# Altium project micro8051.PrjPcb
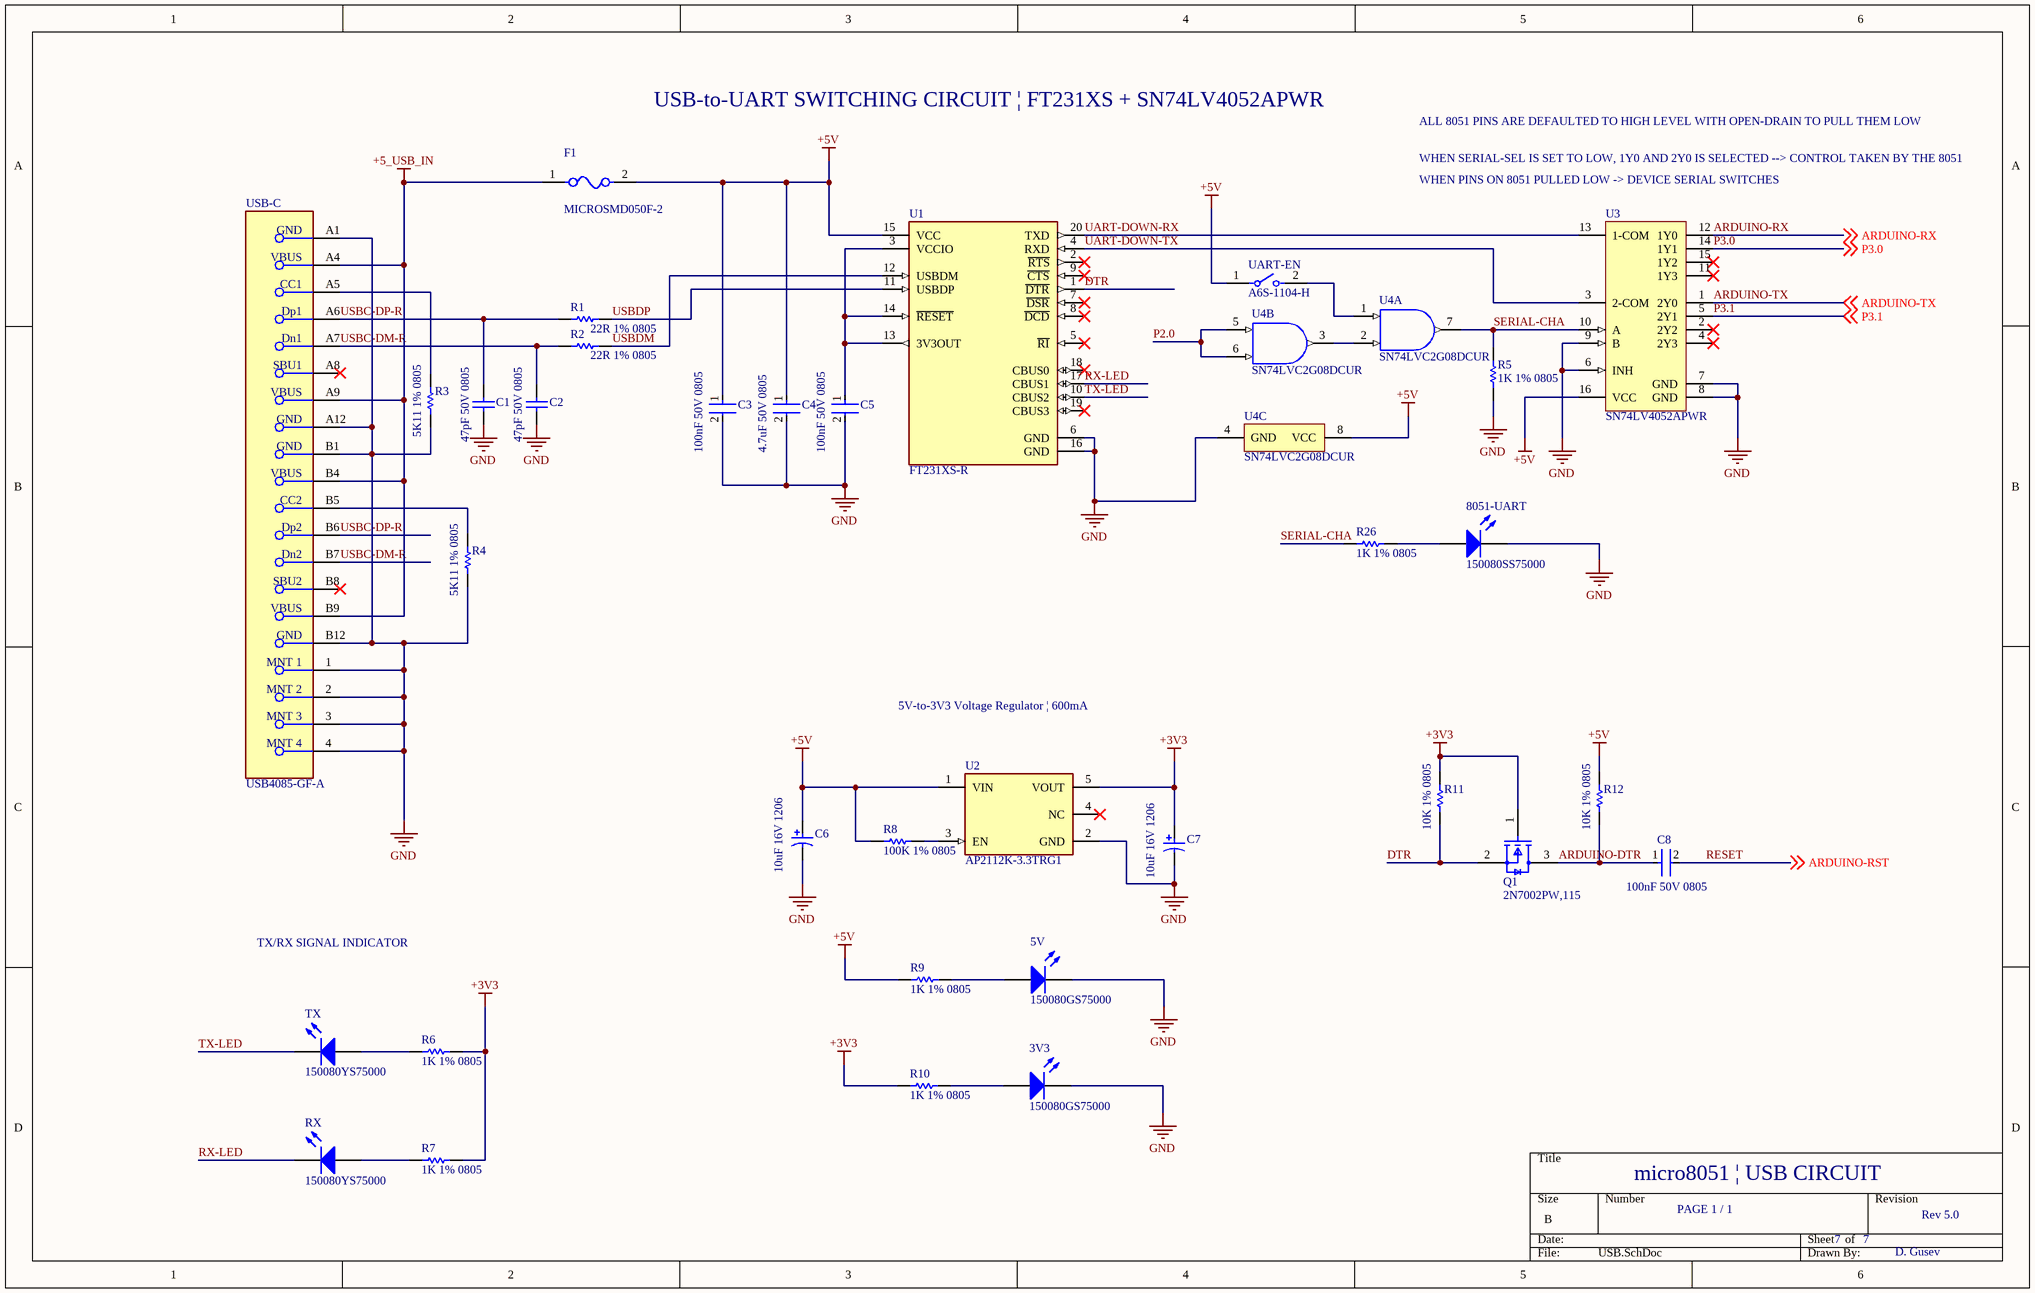
[diagram p0: USB.SchDoc]
3 sheets, 67 parts. Net scope: global (net labels, ports and power ports of the same name join across sheets).
Board file: micro8051.PcbDoc
Sheets:
  USB.SchDoc
  ISP.SchDoc
  micro8051.SchDoc

## Sheet USB.SchDoc
size B

### Parts
3V3  150080GS75000  [0805_A]
5V  150080GS75000  [0805_A]
8051-UART  150080SS75000  [0805_A]
C1  47pF 50V 0805  [CAPC2013X71X50NL20T25]
C2  47pF 50V 0805  [CAPC2013X71X50NL20T25]
C3  100nF 50V 0805  [FP-C0805C-DN-MFG]
C4  4.7uF 50V 0805  [FP-C2012-125-MFG]
C5  100nF 50V 0805  [FP-C0805C-DN-MFG]
C6  10uF 16V 1206  [KEMT-A-3216-18-2_M]
C7  10uF 16V 1206  [KEMT-A-3216-18-2_M]
C8  100nF 50V 0805  [FP-C0805C-DN-MFG]
F1  MICROSMD050F-2  [FP-microSMD-MFG]
Q1  2N7002PW,115  [FP-SOT323-MFG]
R1  22R 1% 0805  [RESC2013X70X40LL20T20]
R2  22R 1% 0805  [RESC2013X70X40LL20T20]
R3  5K11 1% 0805  [RESC0805(2012)_N]
R4  5K11 1% 0805  [RESC0805(2012)_N]
R5  1K 1% 0805  [RESC2013X60X40ML20T25]
R6  1K 1% 0805  [RESC2013X60X40ML20T25]
R7  1K 1% 0805  [RESC2013X60X40ML20T25]
R8  100K 1% 0805  [RESC2013X60X35ML10T20]
R9  1K 1% 0805  [RESC2013X60X40ML20T25]
R10  1K 1% 0805  [RESC2013X60X40ML20T25]
R11  10K 1% 0805  [RESC2013X60X35NL10T20]
R12  10K 1% 0805  [RESC2013X60X35NL10T20]
R26  1K 1% 0805  [RESC2013X60X40ML20T25]
RX  150080YS75000  [0805_A]
TX  150080YS75000  [0805_A]
U1  FT231XS-R  [FP-SSOP-20-MFG]
U2  AP2112K-3.3TRG1  [FP-SOT25-IPC_A]
U3  SN74LV4052APWR  [PW0016A_M]
U4  SN74LVC2G08DCUR  [DCU0008A_M]  (parts A,B,C of 3)
UART-EN  A6S-1104-H  [FP-A6S-1104-H-MFG]
USB-C  USB4085-GF-A  [FP-USB4085-GF-A-MFG]

### Nets
+3V3: C7.1 Q1.1(G) R6.1 R7.1 R10.2 R11.2 U2.5(VOUT)
+5_USB_IN: F1.1 USB-C.A4(VBUS) USB-C.A9(VBUS) USB-C.B4(VBUS) USB-C.B9(VBUS)
+5V: C3.1 C4.1 C6.1 F1.2 R8.2 R9.2 R12.2 U1.15(VCC) U2.1(VIN) U3.16(VCC) U4.8(VCC) UART-EN.1
GND: 3V3.1(K) 5V.1(K) 8051-UART.1(K) C1.1 C2.1 C3.2 C4.2 C5.2 C6.2 C7.2 R3.1 R4.1 R5.2 U1.6(GND) U1.16(GND) U2.2(GND) U3.6(INH) U3.7(GND) U3.8(GND) U3.9(B) U4.4(GND) USB-C.1(MNT_1) USB-C.2(MNT_2) USB-C.3(MNT_3) USB-C.4(MNT_4) USB-C.A1(GND) USB-C.A12(GND) USB-C.B1(GND) USB-C.B12(GND)
ARDUINO-DTR: C8.1 Q1.3(D) R12.1
ARDUINO-RX: U3.12(1Y0) ; off-sheet ARDUINO-RX
ARDUINO-TX: U3.1(2Y0) ; off-sheet ARDUINO-TX
DTR: Q1.2(S) R11.1 U1.1(~{DTR})
P2.0: U4.5(2A) U4.6(2B)
P3.0: U3.14(1Y1) ; off-sheet P3.0
P3.1: U3.5(2Y1) ; off-sheet P3.1
RESET: C8.2 ; off-sheet ARDUINO-RST  [also labelled ARDUINO-RST]
RX-LED: RX.1(K) U1.17(CBUS1)
SERIAL-CHA: R5.1 R26.1 U3.10(A) U4.7(1Y)
TX-LED: TX.1(K) U1.10(CBUS2)
UART-DOWN-RX: U1.20(TXD) U3.13(1-COM)
UART-DOWN-TX: U1.4(RXD) U3.3(2-COM)
USBC-DM-R: C2.2 R2.1 USB-C.A7(Dn1) USB-C.B7(Dn2)
USBC-DP-R: C1.2 R1.1 USB-C.A6(Dp1) USB-C.B6(Dp2)
USBDM: R2.2 U1.12(USBDM)
USBDP: R1.2 U1.11(USBDP)
Net3V3_2: 3V3.2(A) R10.1
Net5V_2: 5V.2(A) R9.1
Net8051-UART_2: 8051-UART.2(A) R26.2
NetC5_1: C5.1 U1.3(VCCIO) U1.13(3V3OUT) U1.14(~{RESET})
NetR3_2: R3.2 USB-C.A5(CC1)
NetR4_2: R4.2 USB-C.B5(CC2)
NetR6_2: R6.2 TX.2(A)
NetR7_2: R7.2 RX.2(A)
NetR8_1: R8.1 U2.3(EN)
NetU4_1: U4.1(1A) UART-EN.2
NetU4_2: U4.2(1B) U4.3(2Y)

Not connected (* = marked no-connect by the designer): U1 2(~{RTS})* 5(~{RI})* 7(~{DSR})* 8(~{DCD})* 9(~{CTS})* 18(CBUS0)* 19(CBUS3)*; U2 4(NC)*; U3 2(2Y2)* 4(2Y3)* 11(1Y3)* 15(1Y2)*; USB-C A8(SBU1)* B8(SBU2)*

### Notes on the sheet
- USB-to-UART SWITCHING CIRCUIT | FT231XS + SN74LV4052APWR
- WHEN SERIAL-SEL IS SET TO LOW, 1Y0 AND 2Y0 IS SELECTED --> CONTROL TAKEN BY THE 8051
- ALL 8051 PINS ARE DEFAULTED TO HIGH LEVEL WITH OPEN-DRAIN TO PULL THEM LOW
- (near U3) WHEN PINS ON 8051 PULLED LOW -> DEVICE SERIAL SWITCHES
- 5V-to-3V3 Voltage Regulator | 600mA
- TX/RX SIGNAL INDICATOR
- micro8051 | USB CIRCUIT
- PAGE 1 / 1
- 7
- Rev 5.0
- D. Gusev

### Library data of the parts
3V3 5V = CMP-1426-00007-1: SMD mono-color Chip LED, WL-SMCW, Green; Manufacturer: Wuerth Elektronik; PackageReference: 0805_A; Color: Green; PartNumber: 150080GS75000; ComponentLink2URL: http://katalog.we-online.com/led/datasheet/150080GS75000.pdf; ComponentLink1URL: http://www.we-online.com; ComponentLink1Description: Manufacturer URL; ComponentLink2Description: Datasheet
8051-UART = CMP-1426-00010-1: SMD mono-color Chip LED, WL-SMCW, Super Red; Manufacturer: Wuerth Elektronik; PackageReference: 0805_A; ComponentLink2URL: http://katalog.we-online.com/led/datasheet/150080SS75000.pdf; ComponentLink1URL: http://www.we-online.com; Color: Super Red; ComponentLink2Description: Datasheet; ComponentLink1Description: Manufacturer URL; PartNumber: 150080SS75000
C1 C2 = CMP-2007-04508-1: Part Number: 08055A470JAT2A; Manufacturer: AVX Interconnect / Elco
C3 C5 C8 = CMP-2007-00279-2: CAP CER 0.1UF 50V X7R 0805; Manufacturer Part Number: C0805C104K5RACTU; Manufacturer: KEMET; Value: 0.10 μF; Tolerance: 0.1; Temperature Coefficient: 30ppm/°C; Material: Ceramic; Device Class L2: Capacitors; Temperature Range Low: -55°C; Voltage Rating: 50 V; Digikey Description: CAP CER 0.1UF 50V X7R 0805; Category: Cap; ComponentLink2Description: Datasheet; Octopart: https://octopart.com/c0805c104k5ractu-kemet-143926; RoHS: TRUE; ComponentLink2URL: https://content.kemet.com/datasheets/KEM_C1003_C0G_SMD.pdf; Temperature Characteristic: X7R; Temperature: -55°C to +125°C; Height: 0.88mm; Temperature Range High: +125°C; Device Class L1: Passive Components; Automotive: No; Lead Free: Yes; Ipc Land Pattern Name: CAPC200125X78; Device Class L3: Ceramic Capacitors; Mouser Description: Cap Ceramic 0.1uF 50V X7R 10% SMD 2.0 x 1.2 mm 125 C Paper T/R; Capacitance: 0.10 μF; Package: C0805C-DN
C4 = CMP-08246-000007-1: CAP CER 4.7UF 50V X5R 0805; Manufacturer Part Number: C2012X5R1H475K125AB; Manufacturer: TDK Corporation; Tolerance: 10%; Temperature Coefficient: 15%; Material: Ceramic; Mouser Description: Multilayer Ceramic Capacitors MLCC - SMD/SMT 0805 4.7uF 50volts X5R 10%; Category: Cap; Temperature Range High: +85°C; Digikey Description: CAP CER 4.7UF 50V X5R 0805; Voltage Rating: 50V; Device Class L1: Passive Components; Temperature Range Low: -55°C; Lead Free: Yes; ComponentLink2Description: Datasheet; Capacitance: 4.7uF; Octopart: https://octopart.com/c2012x5r1h475k125ab-tdk-25947720; Device Class L2: Capacitors; Value: 4.7uF; Temperature: -55°C to +85°C; ComponentLink2URL: https://product.tdk.com/info/en/catalog/datasheets/mlcc_commercial_general_en.pdf; RoHS: TRUE; Height: 1.45mm; Temperature Characteristic: X5R; Package: C2012-125; Device Class L3: Ceramic Capacitors; Automotive: No
C6 C7 = CMP-2000-05173-1: Capacitor, Tantalum, 10 uF, +/- 10%, 16 V, -55 to 125 degC, 2-Pin SMD (1206), RoHS, Tape and Reel; Manufacturer: Kemet; Insulation: NotRequired; Voltage: 16VDC; Product Height (mm): 1.6mm; Polarity: Polar; Lead Spacing (nom): NotRequiredmm; Product Length (mm): 3.2mm; Case Style: Molded; DCL: 1.6uA; ESR: 7ohm; DF: 8%; Mounting Style: SurfaceMount; Manufacturer URL: http://www.kemet.com/; Datasheet Version: Apr-14; Package Description: 2-Pin Surface Mount Device, Body 3.2 x 1.6 mm; Operating Temp Range: -55Cto125C; Package Reference: 1206; Capacitance: 10uF; Wire Form: NotRequired; Datasheet URL: http://www.farnell.com/datasheets/1824869.pdf; Tolerance (+ or -): 10%; Failure Rate: NotRequired; Length W/Weld: NotRequiredmm; Package / Case: 3216-18; Seated Plane Height: NotRequiredmm; Product Diameter (mm): NotRequiredmm; Construction: SMTChip; Seal: NotRequired; Case Code: A; Product Depth (mm): 1.6mm; Packaging: TapeandReel
F1 = CMP-08606-000015-1: PTC RESET FUSE 13.2V 500MA 1210; Manufacturer: Littelfuse; Hold Current: 0.5A; Resistance: 0.25-0.9Ω; Trip Time: 0.05s; Value: 0.25-0.9Ω; Trip Current: 1A; Current Rating: 40A; Device Class L3: unset; ComponentLink2URL: https://www.littelfuse.com/~/media/electronics/datasheets/resettable_ptcs/littelfuse_ptc_microsmd_datasheet.pdf.pdf; Temperature: to +85°C; ComponentLink2Description: Datasheet; RoHS: TRUE; Category: Fuse; Ambient Temperature Range Low: -40°C; Lead Free: Yes; Device Class L1: Circuit Protection; Manufacturer Part Number: MICROSMD050F-2; Temperature Range High: +85°C; Ambient Temperature Range High: +85°C; Automotive: No; Height: 0.62mm; Digikey Description: PTC RESET FUSE 13.2V 500MA 1210; Voltage Rating: 13.2V; Package: microSMD; Octopart: https://octopart.com/microsmd050f-2-littelfuse-74214982; Device Class L2: PTC Resettable Fuses
Q1 = CMP-14409-000019-1: MOSFET N-CH 60V 0.31A SOT323
R1 R2 = CMP-2001-00523-1: Part Number: ERJ6ENF22R0V; Manufacturer: Panasonic
R3 R4 = CMP-1013-00591-1: 5K11 0.125W 1% 0805 (2012 Metric)  SMD; Case-Metric: 2012; Value: 5110.00 Ohm; Case-EIA: 0805; Technology: SMT; Tolerance: 1 %; Power: 0.125 W
R5-R7 R9 R10 R26 = CMP-2001-00590-1: Part Number: ERA6AEB123V; Manufacturer: Panasonic
R8 = CMP-2100-03668-1: Chip Resistor, 100 KOhm, +/- 1%, 0.125 W, -55 to 155 degC, 0805 (2012 Metric), RoHS, Tape and Reel; Manufacturer: Yageo; Max Power Dissipation: 125mW; Voltage Rating: 150V; Temperature Coefficient: 100ppm/degreesC; Manufacturer URL: http://www.yageo.com/; Min Operating Temperature: -55degC; Lead Pitch: 0.4mm; Composition: ThickFilm; Case Code (Metric): 2012; Military Standard: Not; Package Description: 2-Pin Surface Mounted Device, Body 2 x 1.25 mm; REACH SVHC: Unknown; RoHSCompliant: true; Depth: 1.25mm; Number of Pins: 2; Lead Free: LeadFree; Resistance: 100KOhm; Datasheet URL: http://www.yageo.com/NewPortal/yageodocoutput?fileName=/pdf/R-Chip/PYu-RC_Group_51_RoHS_L_5.pdf; Max Operating Temperature: 155degC; Case/Package: 0805; Package Quantity: 1; Case Code (Imperial): 0805; Power Rating: 125mW; Width: 0.049inch; Package Reference: 0805; Height: 0.024inch; Termination: SMD/SMT; Tolerance: 1%; Datasheet Version: Rev. 5, 10/2016; Length: 2mm; Voltage Rating (DC): 150V; Number of Terminations: 2; Packaging: TapeandReel
R11 R12 = CMP-1659-00013-4: Chip Resistor, 10 KOhm, +/- 1%, 0.125 W, -55 to 155 degC, 0805 (2012 Metric), RoHS, Tape and Reel; Manufacturer: Yageo; Voltage Rating: 150 V; Mount: Surface Mount; ComponentLink1Description: Manufacturer URL; ComponentLink2URL: http://www.yageo.com/documents/recent/PYu-RC_Group_51_RoHS_L_04.pdf; Pins: 2; Length: 2 mm; Min Operating Temperature: -55 degC; Height: 0.5 mm; Mounting Technology: Surface Mount; RoHSCompliant: true; REACH SVHC: No SVHC; ComponentLink1URL: http://www.yageo.com/; Max Operating Temperature: 155 degC; PackageReference: 0805; DatasheetVersion: Rev. 4, 02/2016; Package Quantity: 5000; Packaging: Tape and Reel; ComponentLink2Description: Datasheet; PackageDescription: 2-Pin Surface Mounted Device, Body 2 x 1.25 mm
RX TX = CMP-1426-00012-1: SMD mono-color Chip LED, WL-SMCW, Yellow; Manufacturer: Wuerth Elektronik; Color: Yellow; ComponentLink1URL: http://www.we-online.com; PackageReference: 0805_A; ComponentLink2URL: http://katalog.we-online.com/led/datasheet/150080YS75000.pdf; ComponentLink1Description: Manufacturer URL; ComponentLink2Description: Datasheet; PartNumber: 150080YS75000
U1 = CMP-0248-00024-3: IC USB SERIAL FULL UART 20SSOP; Operating Supply Voltage: 5V; Operating Supply Current: 8mA; Number of Channels: 1; Min Supply Voltage: 2.97V; Max Supply Voltage: 5.5V; Data Rate: 12Mbps; Height: 0.059inch; Packaging: Tape and Reel; Mount: Surface Mount; Package Quantity: 2000; Radiation Hardening: No; Case/Package: SSOP; Min Operating Temperature: -40°C; Width: 0.157inch; Number of Pins: 20; Weight: 0.016oz; Interface: UART; Max Operating Temperature: 85°C; Length: 8.74mm
U2 = CMP-12756-000035-1: IC REG LINEAR 3.3V 600MA SOT25; Number of Regulators: 1; Output Type: Fixed; Polarity: Positive; Min Input Voltage: 2.5V; Max Input Voltage: 6V; Accuracy: 1.5%; Quiescent Current: 55uA; Dropout Voltage: 250mV; Min Operating Temperature: -40°C; Length: 3.1mm; Output Current: 600mA; Max Operating Temperature: 85°C; Package Quantity: 1; Output Voltage: 3.3V; Width: 1.7mm; Number of Outputs: 1; Packaging: Tape and Reel; Height: 1.3mm; Lead Free: Lead Free; Max Output Current: 600mA; Case/Package: SOT-23-5; Mount: Surface Mount; Number of Pins: 5
U3 = CMP-0802-00041-4: Dual 4-Channel Analog Multiplexer/Demultiplexer, PW0016A, LARGE T&R; Manufacturer: Texas Instruments; VCC(Min)(V): 2; Crosstalk: Yes; Rating: Catalog; Ron(Max)(Ohms): 75; Ron(Typ)(Ohms): 25; Configuration: 2 X 1：4 MUX; VCC(Max)(V): 5.5; Bandwidth(Max)(MHz): 50; Output Type: CMOS; PackageReference: PW0016A; Operating Temperature Range(C): -40 to 85; DatasheetVersion: SCLS429J; PackageVersion: http://www.ti.com/lit/ml/mpds361/mpds361.pdf; Generic Part Number: SN74LV4052A; Code_JEDEC: MO-153
U4 = CMP-0859-00670-3: Dual 2-Input Positive-AND Gate, DCU0008A, LARGE T&R; Manufacturer: Texas Instruments; Logic: True; Output Drive (IOL/IOH)(Max)(mA): 32/-32; F @ Nom Voltage(Max)(Mhz): 150; Technology Family: LVC; Rating: Catalog; tpd @ Nom Voltage(Max)(ns): 9.8,5.8,5.3,4.8; Voltage(Nom)(V): 1.8,2.5,3.3,5; Schmitt Trigger: No; Input Type: CMOS/TTL; Bits(#): 2; Gate Type: AND; VCC(Max)(V): 5.5; VCC(Min)(V): 1.65; ICC @ Nom Voltage(Max)(mA): 0.01; Output Type: CMOS; Sub-Family: AND Gate; PackageReference: DCU0008A; Operating Temperature Range(C): -40 to 125,-40 to 85; 3-State Output: No; DatasheetVersion: SCES198M; Generic Part Number: SN74LVC2G08
UART-EN = CMP-08827-000005-1: SWITCH SLIDE DIP SPST 25MA 24V; Manufacturer: Omron Electronics Inc-EMC Div; Throw Configuration: SPST-NO; Standoff Height: 0mm; Number Of Circuits: 1; Electromechanical Life: 1000Cycles; Contact Resistance: 200mΩ; Digikey Description: SWITCH SLIDE DIP SPST 25MA 24V; ComponentLink2Description: Datasheet; Mount: Surface Mount; Manufacturer Part Number: A6S-1104-H; ComponentLink2URL: https://omronfs.omron.com/en_US/ecb/products/pdf/en-a6s.pdf; Category: Switch; Height: 3.95mm; Device Class L3: DIP Switches; Octopart: https://octopart.com/a6s-1104-h-omron-55410938; Mouser Description: DIP Switches / SIP Switches Dip Switch; Lead Free: Yes; Temperature Range Low: -20°C; Temperature Range High: +70°C; Automotive: No; Ambient Temperature Range Low: -20°C; Ambient Temperature Range High: +70°C; Voltage Rating Dc: 24V; Device Class L2: Switches; RoHS: TRUE; Package: 0; Contact Current Rating: 25mA; Device Class L1: Electromechanical; Temperature: -20°C to +70°C
USB-C = CMP-196119-000001-1: CONN RCPT USB2.0 TYPEC 16POS; Manufacturer: Global Connector Technology; Voltage Rating: 20V; Conn Orientation: Right Angle; Shielding: true; Current Rating: 4.25A; Number Of Contacts: 16; Pitch: 0.85mm; Is Female: yes; ComponentLink2URL: https://gct.co/files/drawings/usb4085.pdf; Category: Conn; Automotive: No; ComponentLink2Description: Datasheet; Height: 3.66mm; Manufacturer Part Number: USB4085-GF-A; Package: 0; Usb Standard: USB 2.0; Octopart: https://octopart.com/usb4085-gf-a-global+connector+technology-94773699; Device Class L3: unset; Digikey Description: CONN RCPT USB2.0 TYPEC 16POS; Temperature Range Low: -40°C; Temperature: -40°C to +85°C; Lead Free: Yes; Contact Material: Gold,Nickel; Device Class L1: Connectors; Temperature Range High: +85°C; Device Class L2: USB Connectors; RoHS: TRUE

## Sheet ISP.SchDoc
size B
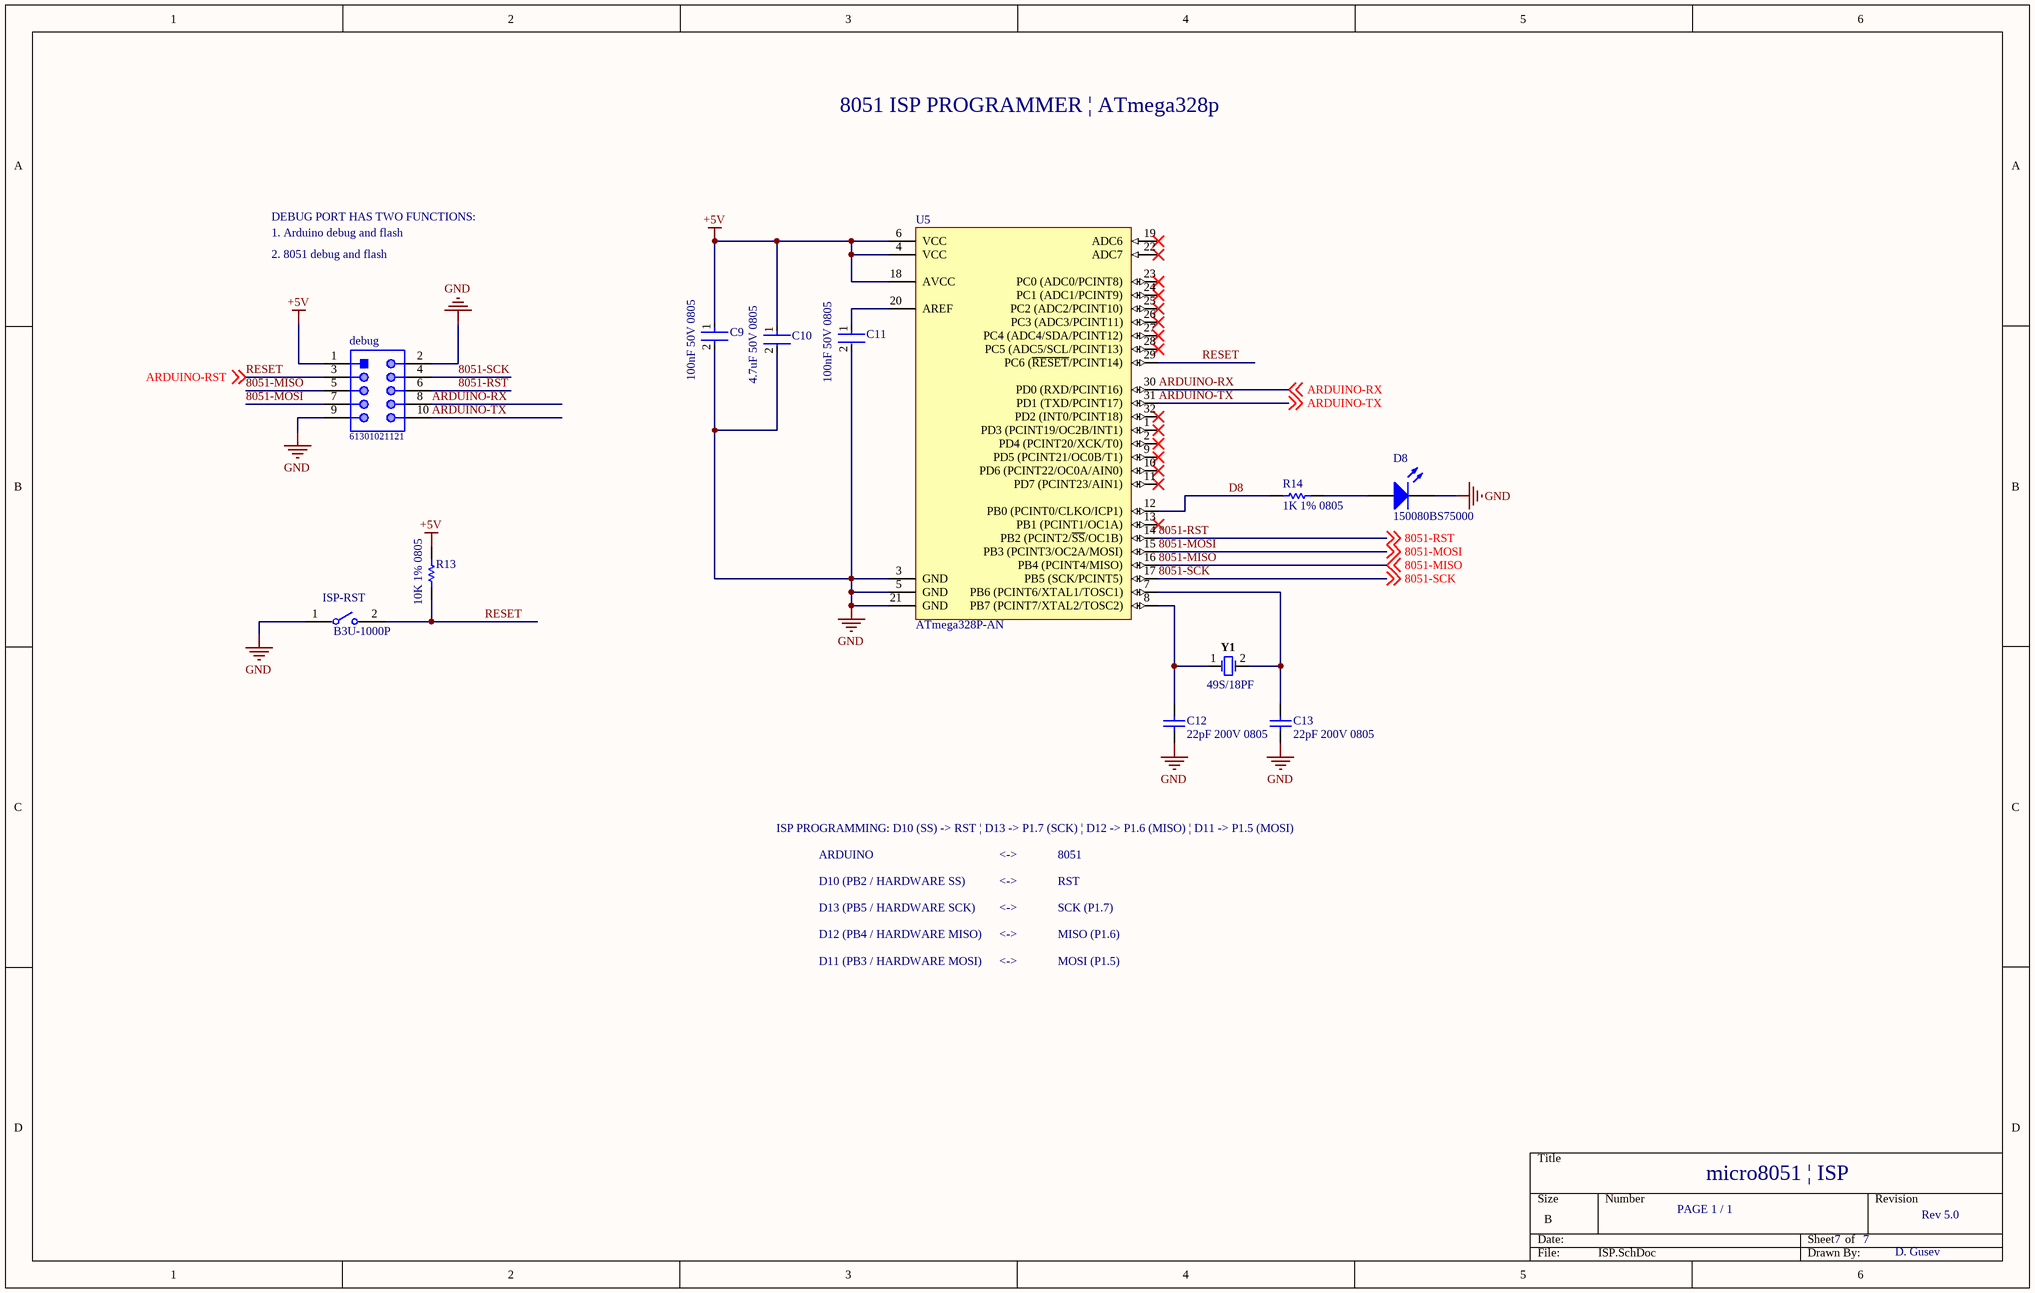
[diagram p1: ISP.SchDoc]

### Parts
C9  100nF 50V 0805  [FP-C0805C-DN-MFG]
C10  4.7uF 50V 0805  [FP-C2012-125-MFG]
C11  100nF 50V 0805  [FP-C0805C-DN-MFG]
C12  22pF 200V 0805  [CAPC2013X115X51NL20T26]
C13  22pF 200V 0805  [CAPC2013X115X51NL20T26]
D8  150080BS75000  [0805_A]
debug  61301021121  [61301021121]
ISP-RST  B3U-1000P  [FP-B3U-1000P-MFG]
R13  10K 1% 0805  [RESC2013X60X35NL10T20]
R14  1K 1% 0805  [RESC2013X60X40ML20T25]
U5  ATmega328P-AN  [32A_N]
Y1  49S/18PF  [JPY-49S-18PF]

### Nets
+5V: C9.1 C10.1 debug.1 R13.2 U5.4(VCC) U5.6(VCC) U5.18(AVCC)
GND: C9.2 C10.2 C11.2 C12.1 C13.1 D8.1(K) debug.2 debug.9 ISP-RST.1 U5.3(GND) U5.5(GND) U5.21(GND)
8051-MISO: debug.5 U5.16(PB4_(PCINT4/MISO)) ; off-sheet 8051-MISO
8051-MOSI: debug.7 U5.15(PB3_(PCINT3/OC2A/MOSI)) ; off-sheet 8051-MOSI
8051-RST: debug.6 U5.14(PB2_(PCINT2/~{SS}/OC1B)) ; off-sheet 8051-RST
8051-SCK: debug.4 U5.17(PB5_(SCK/PCINT5)) ; off-sheet 8051-SCK
ARDUINO-RX: debug.8 U5.30(PD0_(RXD/PCINT16)) ; off-sheet ARDUINO-RX
ARDUINO-TX: debug.10 U5.31(PD1_(TXD/PCINT17)) ; off-sheet ARDUINO-TX
D8: R14.2 U5.12(PB0_(PCINT0/CLKO/ICP1))
RESET: debug.3 ISP-RST.2 R13.1 U5.29(PC6_(~{RESET}/PCINT14)) ; off-sheet ARDUINO-RST  [also labelled ARDUINO-RST]
NetC11_1: C11.1 U5.20(AREF)
NetC12_2: C12.2 U5.8(PB7_(PCINT7/XTAL2/TOSC2)) Y1.1
NetC13_2: C13.2 U5.7(PB6_(PCINT6/XTAL1/TOSC1)) Y1.2
NetD8_2: D8.2(A) R14.1

Not connected (* = marked no-connect by the designer): U5 1(PD3_(PCINT19/OC2B/INT1))* 2(PD4_(PCINT20/XCK/T0))* 9(PD5_(PCINT21/OC0B/T1))* 10(PD6_(PCINT22/OC0A/AIN0))* 11(PD7_(PCINT23/AIN1))* 13(PB1_(PCINT1/OC1A))* 19(ADC6)* 22(ADC7)* 23(PC0_(ADC0/PCINT8))* 24(PC1_(ADC1/PCINT9))* 25(PC2_(ADC2/PCINT10))* 26(PC3_(ADC3/PCINT11))* 27(PC4_(ADC4/SDA/PCINT12))* 28(PC5_(ADC5/SCL/PCINT13))* 32(PD2_(INT0/PCINT18))*

### Notes on the sheet
- 8051 ISP PROGRAMMER | ATmega328p
- DEBUG PORT HAS TWO FUNCTIONS:
- 1. Arduino debug and flash
- 2. 8051 debug and flash
- ISP PROGRAMMING: D10 (SS) -> RST | D13 -> P1.7 (SCK) | D12 -> P1.6 (MISO) | D11 -> P1.5 (MOSI)
- ARDUINO
- D10 (PB2 / HARDWARE SS)
- D13 (PB5 / HARDWARE SCK)
- <->
- 8051
- SCK (P1.7)
- RST
- D12 (PB4 / HARDWARE MISO)
- D11 (PB3 / HARDWARE MOSI)
- MISO (P1.6)
- MOSI (P1.5)
- PAGE 1 / 1
- micro8051 | ISP
- 7
- Rev 5.0
- D. Gusev

### Library data of the parts
C9 C11 = CMP-2007-00279-2: as C3 on sheet USB; Device Class L2: Capacitors; Temperature Range Low: -55°C; Voltage Rating: 50 V; Digikey Description: CAP CER 0.1UF 50V X7R 0805; Category: Cap; ComponentLink2Description: Datasheet; Octopart: https://octopart.com/c0805c104k5ractu-kemet-143926; RoHS: TRUE; ComponentLink2URL: https://content.kemet.com/datasheets/KEM_C1003_C0G_SMD.pdf; Temperature Characteristic: X7R; Temperature: -55°C to +125°C; Height: 0.88mm; Temperature Range High: +125°C; Device Class L1: Passive Components; Automotive: No; Lead Free: Yes; Ipc Land Pattern Name: CAPC200125X78; Device Class L3: Ceramic Capacitors; Mouser Description: Cap Ceramic 0.1uF 50V X7R 10% SMD 2.0 x 1.2 mm 125 C Paper T/R; Capacitance: 0.10 μF; Package: C0805C-DN
C10 = CMP-08246-000007-1: as C4 on sheet USB; Mouser Description: Multilayer Ceramic Capacitors MLCC - SMD/SMT 0805 4.7uF 50volts X5R 10%; Category: Cap; Temperature Range High: +85°C; Digikey Description: CAP CER 4.7UF 50V X5R 0805; Voltage Rating: 50V; Device Class L1: Passive Components; Temperature Range Low: -55°C; Lead Free: Yes; ComponentLink2Description: Datasheet; Capacitance: 4.7uF; Octopart: https://octopart.com/c2012x5r1h475k125ab-tdk-25947720; Device Class L2: Capacitors; Value: 4.7uF; Temperature: -55°C to +85°C; ComponentLink2URL: https://product.tdk.com/info/en/catalog/datasheets/mlcc_commercial_general_en.pdf; RoHS: TRUE; Height: 1.45mm; Temperature Characteristic: X5R; Package: C2012-125; Device Class L3: Ceramic Capacitors; Automotive: No
C12 C13 = CMP-2007-04866-1: Manufacturer: AVX Interconnect / Elco; Part Number: 08052U220GAT2A
D8 = CMP-1426-00008-1: SMD mono-color Chip LED, WL-SMCW, Blue; Manufacturer: Wuerth Elektronik; Color: Blue; ComponentLink2URL: http://katalog.we-online.com/led/datasheet/150080BS75000.pdf; ComponentLink1URL: http://www.we-online.com; ComponentLink2Description: Datasheet; PackageReference: 0805_A; ComponentLink1Description: Manufacturer URL; PartNumber: 150080BS75000
debug = CMP-1502-01084-1: THT Vertical Pin Header WR-PHD, Pitch 2.54 mm, Dual Row, 10 pins; Manufacturer: Wurth Elektronik; Working Voltage: 250VAC; Pitch: 2.54mm; Contact Resistance: 20mOhm; Gender: Male; Rated Current: 3A; Withstanding Voltage: 500VAC; Pin Number: 10; Operating Temperature: -40to105degC; Mounting Technology: THT; Publisher: WurthElektronik; Manufacturer URL: http://www.we-online.de; Part Number: 61301021121; Row Number: Dual; Packaging: Bag; Orientation: Vertical; Package Reference: 61301021121; Datasheet URL: https://katalog.we-online.de/em/datasheet/6130xx21121.pdf
ISP-RST = CMP-2100-03586-2: SWITCH TACTILE SPST-NO 0.05A 12V; Contact Resistance: 100mR; Operating Force: 1.5N; Max Current Rating: 50mA; Switch Travel: 0.15mm; Actuator Type: Standard; Mechanical Life: 200000Cycles; Ratings: Dust Proof; Illumination Type: Non-Illuminated; Throw Configuration: SPST; Actuator Length: 0.4mm; Switch Function: Off-Mom; Height: 1.2mm; Width: 3mm; Weight: 0.000776oz; Contact Material: Silver; Max Voltage Rating (DC): 12V; Insulation Resistance: 100MR; Lead Free: Lead Free; Current Rating: 50mA; Termination: SMD/SMT; Length: 4mm; Voltage Rating (DC): 12V; Contact Current Rating: 50mA; Orientation: Straight; Depth: 2.5mm; Max Operating Temperature: 70°C; Packaging: Tape and Reel; Min Operating Temperature: -25°C; Package Quantity: 1; Mount: Surface Mount; Electrical Life: 200000Cycles
R13 = CMP-1659-00013-4: as R11 on sheet USB; Mount: Surface Mount; ComponentLink1Description: Manufacturer URL; ComponentLink2URL: http://www.yageo.com/documents/recent/PYu-RC_Group_51_RoHS_L_04.pdf; Pins: 2; Length: 2 mm; Min Operating Temperature: -55 degC; Height: 0.5 mm; Mounting Technology: Surface Mount; RoHSCompliant: true; REACH SVHC: No SVHC; ComponentLink1URL: http://www.yageo.com/; Max Operating Temperature: 155 degC; PackageReference: 0805; DatasheetVersion: Rev. 4, 02/2016; Package Quantity: 5000; Packaging: Tape and Reel; ComponentLink2Description: Datasheet; PackageDescription: 2-Pin Surface Mounted Device, Body 2 x 1.25 mm
R14 = CMP-2001-00590-1: as R5 on sheet USB
U5 = CMP-0095-00620-1: 8-bit AVR Microcontroller, 32KB Flash, 1KB EEPROM, 2KB SRAM, 32-pin TQFP, Industrial Grade (-40°C to 105°C); DatasheetVersion: revD, May-2011; ComponentLink1URL: http://www.atmel.com/; PackageReference: 32A; ComponentLink2URL: http://www.atmel.com/dyn/resources/prod_documents/8271.pdf; ComponentLink1Description: Manufacturer URL; ComponentLink3URL: http://www.atmel.com/dyn/resources/prod_documents/8271S.pdf; PackageVersion: revC, Oct-2010; Code_JEDEC: MS-026-ABA; ComponentLink2Description: ATmega48A/48PA/88A/88PA/168A/168PA/328/328P Datasheet; PackageDescription: 32-Lead, 7x7x1.0 mm Body, 0.8mm Lead Pitch, Thin Profile Plastic Quad Flat Package (TQFP); ComponentLink3Description: ATmega48A/48PA/88A/88PA/168A/168PA/328/328P Summary
Y1 = CMP-2100-03581-1: Crystal, 16 MHz, 18 pF, -20 to 70 degC, 2-Pin THD; Manufacturer: Shenzhen Jingpengyuan; Package Description: 2-Pin Through Hole Device, Body 11.05 x 4.65 mm, Pitch 4.88 mm; Package Reference: 49S-18PF; Datasheet Version: 41852.0; Datasheet URL: http://datasheet.octopart.com/49S-18PF-Xinhunjing-datasheet-30677139.pdf; Manufacturer URL: http://www.chjiahui.com/

## Sheet micro8051.SchDoc
size B
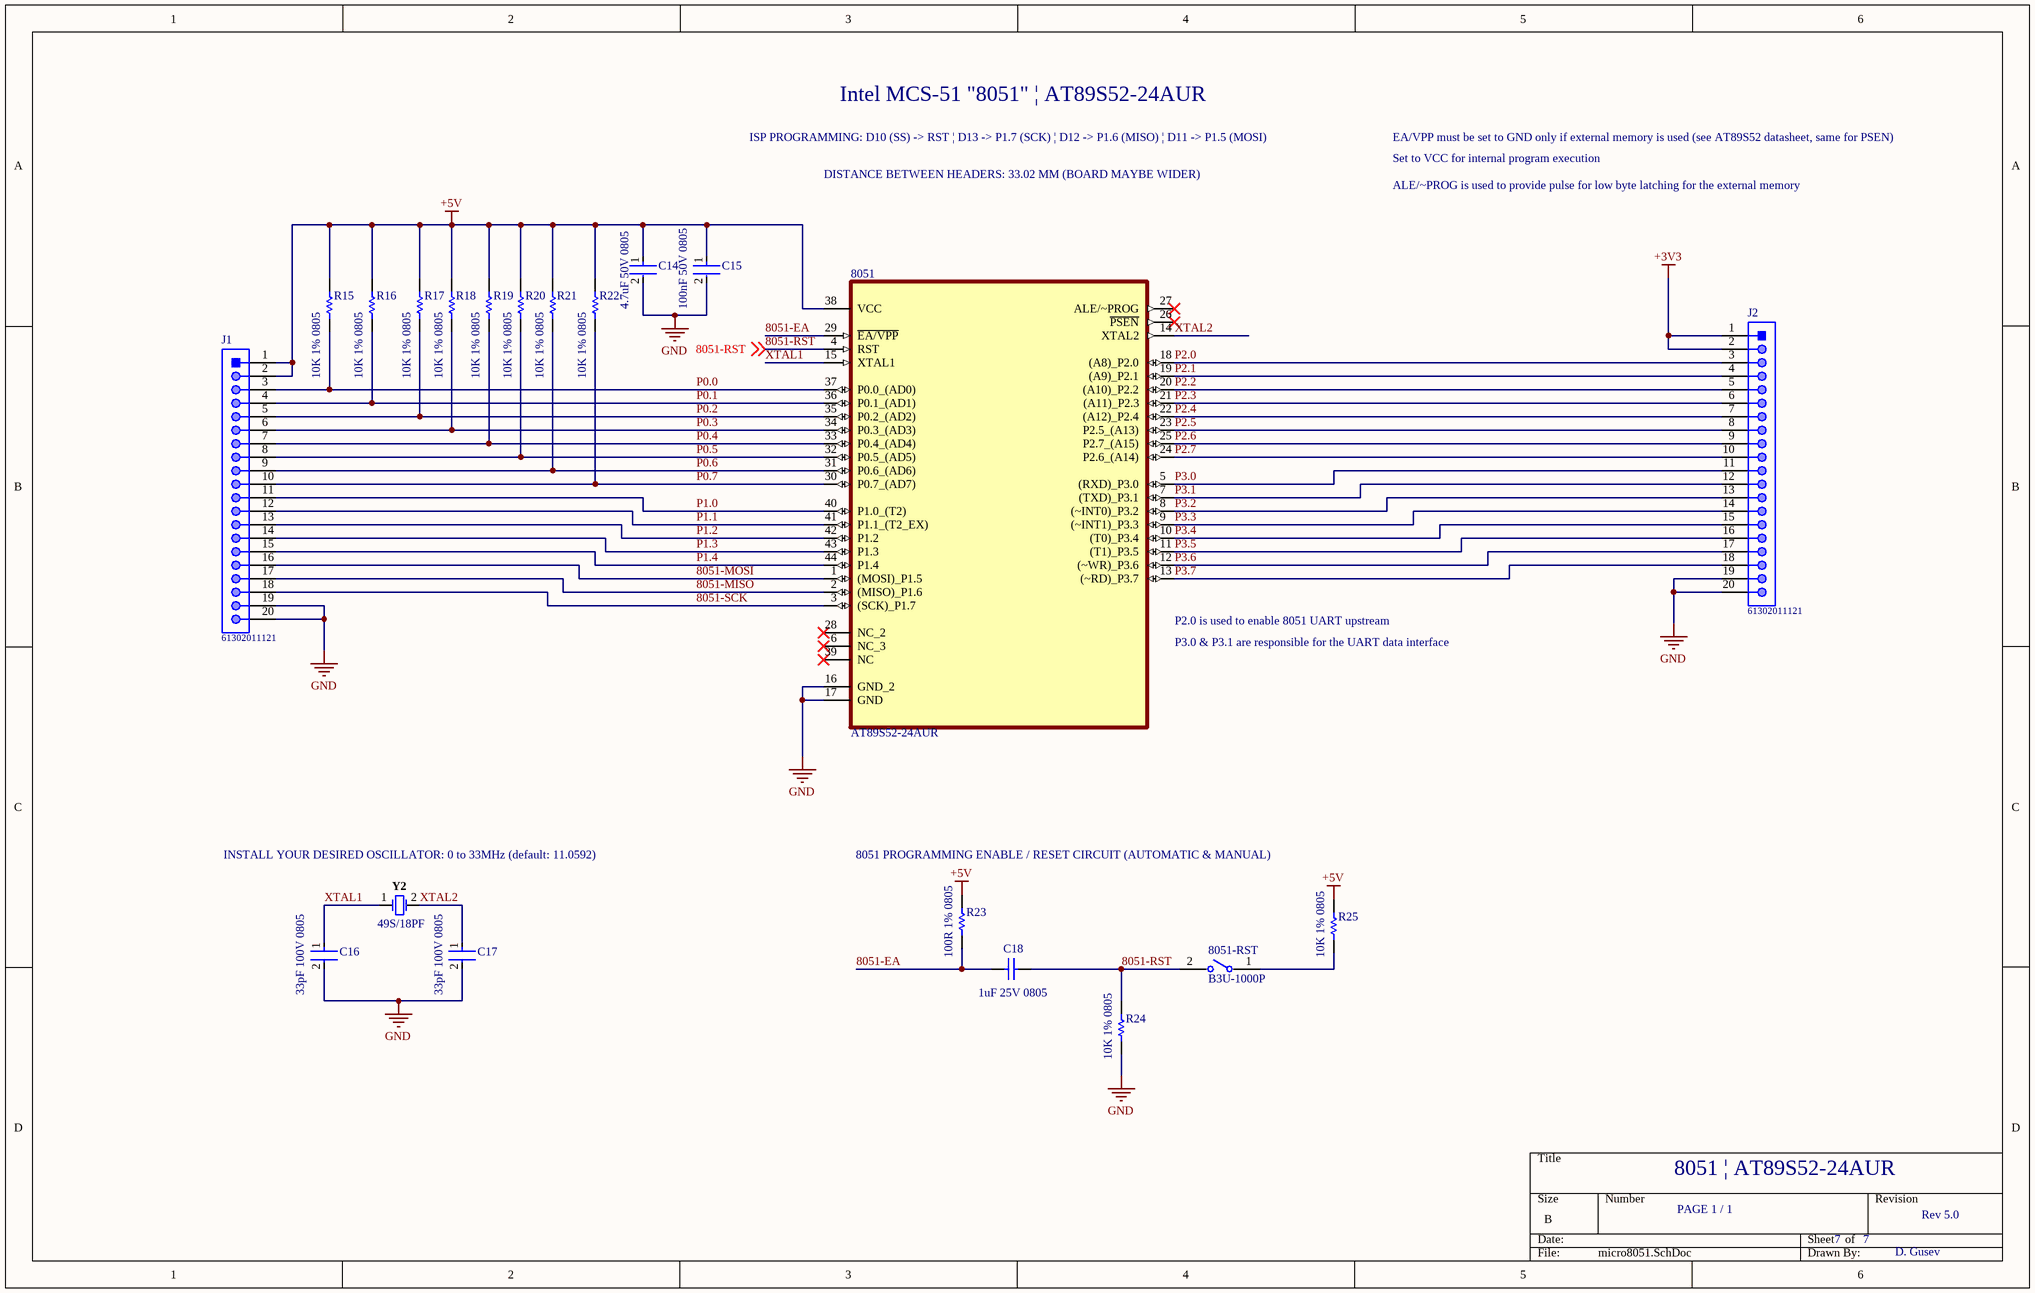
[diagram p2: micro8051.SchDoc]

### Parts
8051  AT89S52-24AUR  [AT89S52-24AUR]
8051-RST  B3U-1000P  [FP-B3U-1000P-MFG]
C14  4.7uF 50V 0805  [FP-C2012-125-MFG]
C15  100nF 50V 0805  [FP-C0805C-DN-MFG]
C16  33pF 100V 0805  [FP-C0805C-DN-MFG]
C17  33pF 100V 0805  [FP-C0805C-DN-MFG]
C18  1uF 25V 0805  [CAPC2013X140X50LL20T25]
J1  61302011121  [61302011121]
J2  61302011121  [61302011121]
R15  10K 1% 0805  [RESC2013X60X35NL10T20]
R16  10K 1% 0805  [RESC2013X60X35NL10T20]
R17  10K 1% 0805  [RESC2013X60X35NL10T20]
R18  10K 1% 0805  [RESC2013X60X35NL10T20]
R19  10K 1% 0805  [RESC2013X60X35NL10T20]
R20  10K 1% 0805  [RESC2013X60X35NL10T20]
R21  10K 1% 0805  [RESC2013X60X35NL10T20]
R22  10K 1% 0805  [RESC2013X60X35NL10T20]
R23  100R 1% 0805  [RESC2013X60X35ML10T20]
R24  10K 1% 0805  [RESC2013X60X35NL10T20]
R25  10K 1% 0805  [RESC2013X60X35NL10T20]
Y2  49S/18PF  [JPY-49S-18PF]

### Nets
+3V3: J2.1 J2.2
+5V: 8051.38(VCC) C14.1 C15.1 J1.1 J1.2 R15.2 R16.2 R17.2 R18.2 R19.2 R20.2 R21.2 R22.2 R23.2 R25.2
GND: 8051.16(GND_2) 8051.17(GND) C14.2 C15.2 C16.2 C17.2 J1.19 J1.20 J2.19 J2.20 R24.1
8051-EA: 8051.29(~{EA/VPP}) C18.1 R23.1
8051-MISO: 8051.2((MISO)_P1.6) J1.17
8051-MOSI: 8051.1((MOSI)_P1.5) J1.16
8051-RST: 8051.4(RST) 8051-RST.2 C18.2 R24.2 ; off-sheet 8051-RST
8051-SCK: 8051.3((SCK)_P1.7) J1.18
P0.0: 8051.37(P0.0_(AD0)) J1.3 R15.1
P0.1: 8051.36(P0.1_(AD1)) J1.4 R16.1
P0.2: 8051.35(P0.2_(AD2)) J1.5 R17.1
P0.3: 8051.34(P0.3_(AD3)) J1.6 R18.1
P0.4: 8051.33(P0.4_(AD4)) J1.7 R19.1
P0.5: 8051.32(P0.5_(AD5)) J1.8 R20.1
P0.6: 8051.31(P0.6_(AD6)) J1.9 R21.1
P0.7: 8051.30(P0.7_(AD7)) J1.10 R22.1
P1.0: 8051.40(P1.0_(T2)) J1.11
P1.1: 8051.41(P1.1_(T2_EX)) J1.12
P1.2: 8051.42(P1.2) J1.13
P1.3: 8051.43(P1.3) J1.14
P1.4: 8051.44(P1.4) J1.15
P2.0: 8051.18((A8)_P2.0) J2.3
P2.1: 8051.19((A9)_P2.1) J2.4
P2.2: 8051.20((A10)_P2.2) J2.5
P2.3: 8051.21((A11)_P2.3) J2.6
P2.4: 8051.22((A12)_P2.4) J2.7
P2.5: 8051.23(P2.5_(A13)) J2.8
P2.6: 8051.25(P2.7_(A15)) J2.9
P2.7: 8051.24(P2.6_(A14)) J2.10
P3.0: 8051.5((RXD)_P3.0) J2.11
P3.1: 8051.7((TXD)_P3.1) J2.12
P3.2: 8051.8((~INT0)_P3.2) J2.13
P3.3: 8051.9((~INT1)_P3.3) J2.14
P3.4: 8051.10((T0)_P3.4) J2.15
P3.5: 8051.11((T1)_P3.5) J2.16
P3.6: 8051.12((~WR)_P3.6) J2.17
P3.7: 8051.13((~RD)_P3.7) J2.18
XTAL1: 8051.15(XTAL1) C16.1 Y2.1
XTAL2: 8051.14(XTAL2) C17.1 Y2.2
Net8051-RST_1: 8051-RST.1 R25.1

Not connected (* = marked no-connect by the designer): 8051 6(NC_3)* 26(~{PSEN})* 27(ALE/~PROG)* 28(NC_2)* 39(NC)*

### Notes on the sheet
- ISP PROGRAMMING: D10 (SS) -> RST | D13 -> P1.7 (SCK) | D12 -> P1.6 (MISO) | D11 -> P1.5 (MOSI)
- Intel MCS-51 "8051" | AT89S52-24AUR
- EA/VPP must be set to GND only if external memory is used (see AT89S52 datasheet, same for PSEN)
- Set to VCC for internal program execution
- DISTANCE BETWEEN HEADERS: 33.02 MM (BOARD MAYBE WIDER)
- ALE/~PROG is used to provide pulse for low byte latching for the external memory
- (near 8051) P2.0 is used to enable 8051 UART upstream
- (near 8051) P3.0 & P3.1 are responsible for the UART data interface
- (near Y2) INSTALL YOUR DESIRED OSCILLATOR: 0 to 33MHz (default: 11.0592)
- (near R23) 8051 PROGRAMMING ENABLE / RESET CIRCUIT (AUTOMATIC & MANUAL)
- 8051 | AT89S52-24AUR
- PAGE 1 / 1
- 7
- Rev 5.0
- D. Gusev

### Library data of the parts
8051-RST = CMP-2100-03586-2: as ISP-RST on sheet ISP; Height: 1.2mm; Width: 3mm; Weight: 0.000776oz; Contact Material: Silver; Max Voltage Rating (DC): 12V; Insulation Resistance: 100MR; Lead Free: Lead Free; Current Rating: 50mA; Termination: SMD/SMT; Length: 4mm; Voltage Rating (DC): 12V; Contact Current Rating: 50mA; Orientation: Straight; Depth: 2.5mm; Max Operating Temperature: 70°C; Packaging: Tape and Reel; Min Operating Temperature: -25°C; Package Quantity: 1; Mount: Surface Mount; Electrical Life: 200000Cycles
C14 = CMP-08246-000007-1: as C4 on sheet USB; Mouser Description: Multilayer Ceramic Capacitors MLCC - SMD/SMT 0805 4.7uF 50volts X5R 10%; Category: Cap; Temperature Range High: +85°C; Digikey Description: CAP CER 4.7UF 50V X5R 0805; Voltage Rating: 50V; Device Class L1: Passive Components; Temperature Range Low: -55°C; Lead Free: Yes; ComponentLink2Description: Datasheet; Capacitance: 4.7uF; Octopart: https://octopart.com/c2012x5r1h475k125ab-tdk-25947720; Device Class L2: Capacitors; Value: 4.7uF; Temperature: -55°C to +85°C; ComponentLink2URL: https://product.tdk.com/info/en/catalog/datasheets/mlcc_commercial_general_en.pdf; RoHS: TRUE; Height: 1.45mm; Temperature Characteristic: X5R; Package: C2012-125; Device Class L3: Ceramic Capacitors; Automotive: No
C15 = CMP-2007-00279-2: as C3 on sheet USB; Device Class L2: Capacitors; Temperature Range Low: -55°C; Voltage Rating: 50 V; Digikey Description: CAP CER 0.1UF 50V X7R 0805; Category: Cap; ComponentLink2Description: Datasheet; Octopart: https://octopart.com/c0805c104k5ractu-kemet-143926; RoHS: TRUE; ComponentLink2URL: https://content.kemet.com/datasheets/KEM_C1003_C0G_SMD.pdf; Temperature Characteristic: X7R; Temperature: -55°C to +125°C; Height: 0.88mm; Temperature Range High: +125°C; Device Class L1: Passive Components; Automotive: No; Lead Free: Yes; Ipc Land Pattern Name: CAPC200125X78; Device Class L3: Ceramic Capacitors; Mouser Description: Cap Ceramic 0.1uF 50V X7R 10% SMD 2.0 x 1.2 mm 125 C Paper T/R; Capacitance: 0.10 μF; Package: C0805C-DN
C16 C17 = CMP-1036-01444-3: CAP CER 33PF 100V 5% NP0 0805; Manufacturer: KEMET; Manufacturer Part Number: C0805C330J1GACTU; Material: Ceramic; Temperature Characteristic: C0G; Temperature Coefficient: 30ppm/°C; Tolerance: 0.05; ComponentLink2URL: https://content.kemet.com/datasheets/KEM_C1003_C0G_SMD.pdf; Package: C0805C-DN; Temperature Range Low: -55°C; Height: 0.88mm; Digikey Description: CAP CER 33PF 100V 5% NP0 0805; Temperature: -55°C to +125°C; Capacitance: 33 pF; Temperature Range High: +125°C; RoHS: TRUE; Automotive: No; Octopart: https://octopart.com/c0805c330j1gactu-kemet-2226180; Mouser Description: Cap Ceramic 33pF 100V C0G 5% SMD 0805 125°C Plastic T/R; Device Class L2: Capacitors; ComponentLink2Description: Datasheet; Voltage Rating: 100 V; Lead Free: Yes; Device Class L1: Passive Components; Device Class L3: Ceramic Capacitors; Ipc Land Pattern Name: CAPC200125X78; Category: Cap; Value: 33 pF
C18 = CMP-2007-03234-1: Part Number: C0805C105K3RACTU; Manufacturer: Kemet
J1 J2 = CMP-1502-01102-1: THT Vertical Pin Header WR-PHD, Pitch 2.54 mm, Single Row, 20 pins; Manufacturer: Wurth Elektronik; Withstanding Voltage: 500VAC; Gender: Male; Pin Number: 20; Rated Current: 3A; Contact Resistance: 20mOhm; Pitch: 2.54mm; Working Voltage: 250VAC; Publisher: WurthElektronik; Packaging: Bag; Datasheet URL: https://katalog.we-online.de/em/datasheet/6130xx11121.pdf; Row Number: Single; Mounting Technology: THT; Manufacturer URL: http://www.we-online.de; Orientation: Vertical; Package Reference: 61302011121; Part Number: 61302011121; Operating Temperature: -40to105degC
R15-R22 R24 R25 = CMP-1659-00013-4: as R11 on sheet USB; Mount: Surface Mount; ComponentLink1Description: Manufacturer URL; ComponentLink2URL: http://www.yageo.com/documents/recent/PYu-RC_Group_51_RoHS_L_04.pdf; Pins: 2; Length: 2 mm; Min Operating Temperature: -55 degC; Height: 0.5 mm; Mounting Technology: Surface Mount; RoHSCompliant: true; REACH SVHC: No SVHC; ComponentLink1URL: http://www.yageo.com/; Max Operating Temperature: 155 degC; PackageReference: 0805; DatasheetVersion: Rev. 4, 02/2016; Package Quantity: 5000; Packaging: Tape and Reel; ComponentLink2Description: Datasheet; PackageDescription: 2-Pin Surface Mounted Device, Body 2 x 1.25 mm
R23 = CMP-2100-03669-1: Chip Resistor, 100 Ohm, +/-1%, 0.125 W, -55 to 155 degC, 0805 (2012 Metric), RoHS, Tape and Reel; Manufacturer: Yageo; Power Rating: 125mW; Resistance: 100Ohm; Voltage Rating: 150V; Temperature Coefficient: 100ppm/degreesC; Length: 2mm; Package Description: 2-Pin Surface Mounted Device, Body 2 x 1.25 mm; Case Code (Imperial): 0805; Number of Pins: 2; Termination: SMD/SMT; Lead Pitch: 0.4mm; Package Quantity: 1; Height: 0.024inch; Case Code (Metric): 2012; Number of Terminations: 2; Datasheet Version: Rev. 5, 10/2016; Lead Free: LeadFree; Package Reference: 0805; Composition: ThickFilm; REACH SVHC: Unknown; Voltage Rating (DC): 150V; Min Operating Temperature: -55degC; Packaging: TapeandReel; Military Standard: Not; Tolerance: 1%; Case/Package: 0805; Datasheet URL: http://www.yageo.com/NewPortal/yageodocoutput?fileName=/pdf/R-Chip/PYu-RC_Group_51_RoHS_L_5.pdf; Max Operating Temperature: 155degC; Manufacturer URL: http://www.yageo.com/; Max Power Dissipation: 125mW; Width: 0.049inch; Depth: 1.25mm; RoHSCompliant: true
Y2 = CMP-2100-03581-1: as Y1 on sheet ISP; Package Description: 2-Pin Through Hole Device, Body 11.05 x 4.65 mm, Pitch 4.88 mm; Package Reference: 49S-18PF; Datasheet Version: 41852.0; Datasheet URL: http://datasheet.octopart.com/49S-18PF-Xinhunjing-datasheet-30677139.pdf; Manufacturer URL: http://www.chjiahui.com/

## Nets that join several sheets
+3V3: USB (7 pins), micro8051 (J2.1 J2.2)
+5V: USB (12 pins), ISP (7 pins), micro8051 (15 pins)
GND: USB (29 pins), ISP (12 pins), micro8051 (11 pins)
8051-MISO: ISP (debug.5 U5.16), micro8051 (8051.2 J1.17)
8051-MOSI: ISP (debug.7 U5.15), micro8051 (8051.1 J1.16)
8051-RST: ISP (debug.6 U5.14), micro8051 (8051.4 8051-RST.2 C18.2 R24.2)
8051-SCK: ISP (debug.4 U5.17), micro8051 (8051.3 J1.18)
ARDUINO-RX: USB (U3.12), ISP (debug.8 U5.30)
ARDUINO-TX: USB (U3.1), ISP (debug.10 U5.31)
P2.0: USB (U4.5 U4.6), micro8051 (8051.18 J2.3)
P3.0: USB (U3.14), micro8051 (8051.5 J2.11)
P3.1: USB (U3.5), micro8051 (8051.7 J2.12)
RESET: USB (C8.2), ISP (debug.3 ISP-RST.2 R13.1 U5.29)